# EasyEDA schematic SCH_fl-test_2024-12-06.json
TITLE: Sheet_1; REV: 1.0; Date: 2024-12-06; Sheet: 1/1; Drawn By: michaelfolger123; Company: Your Company
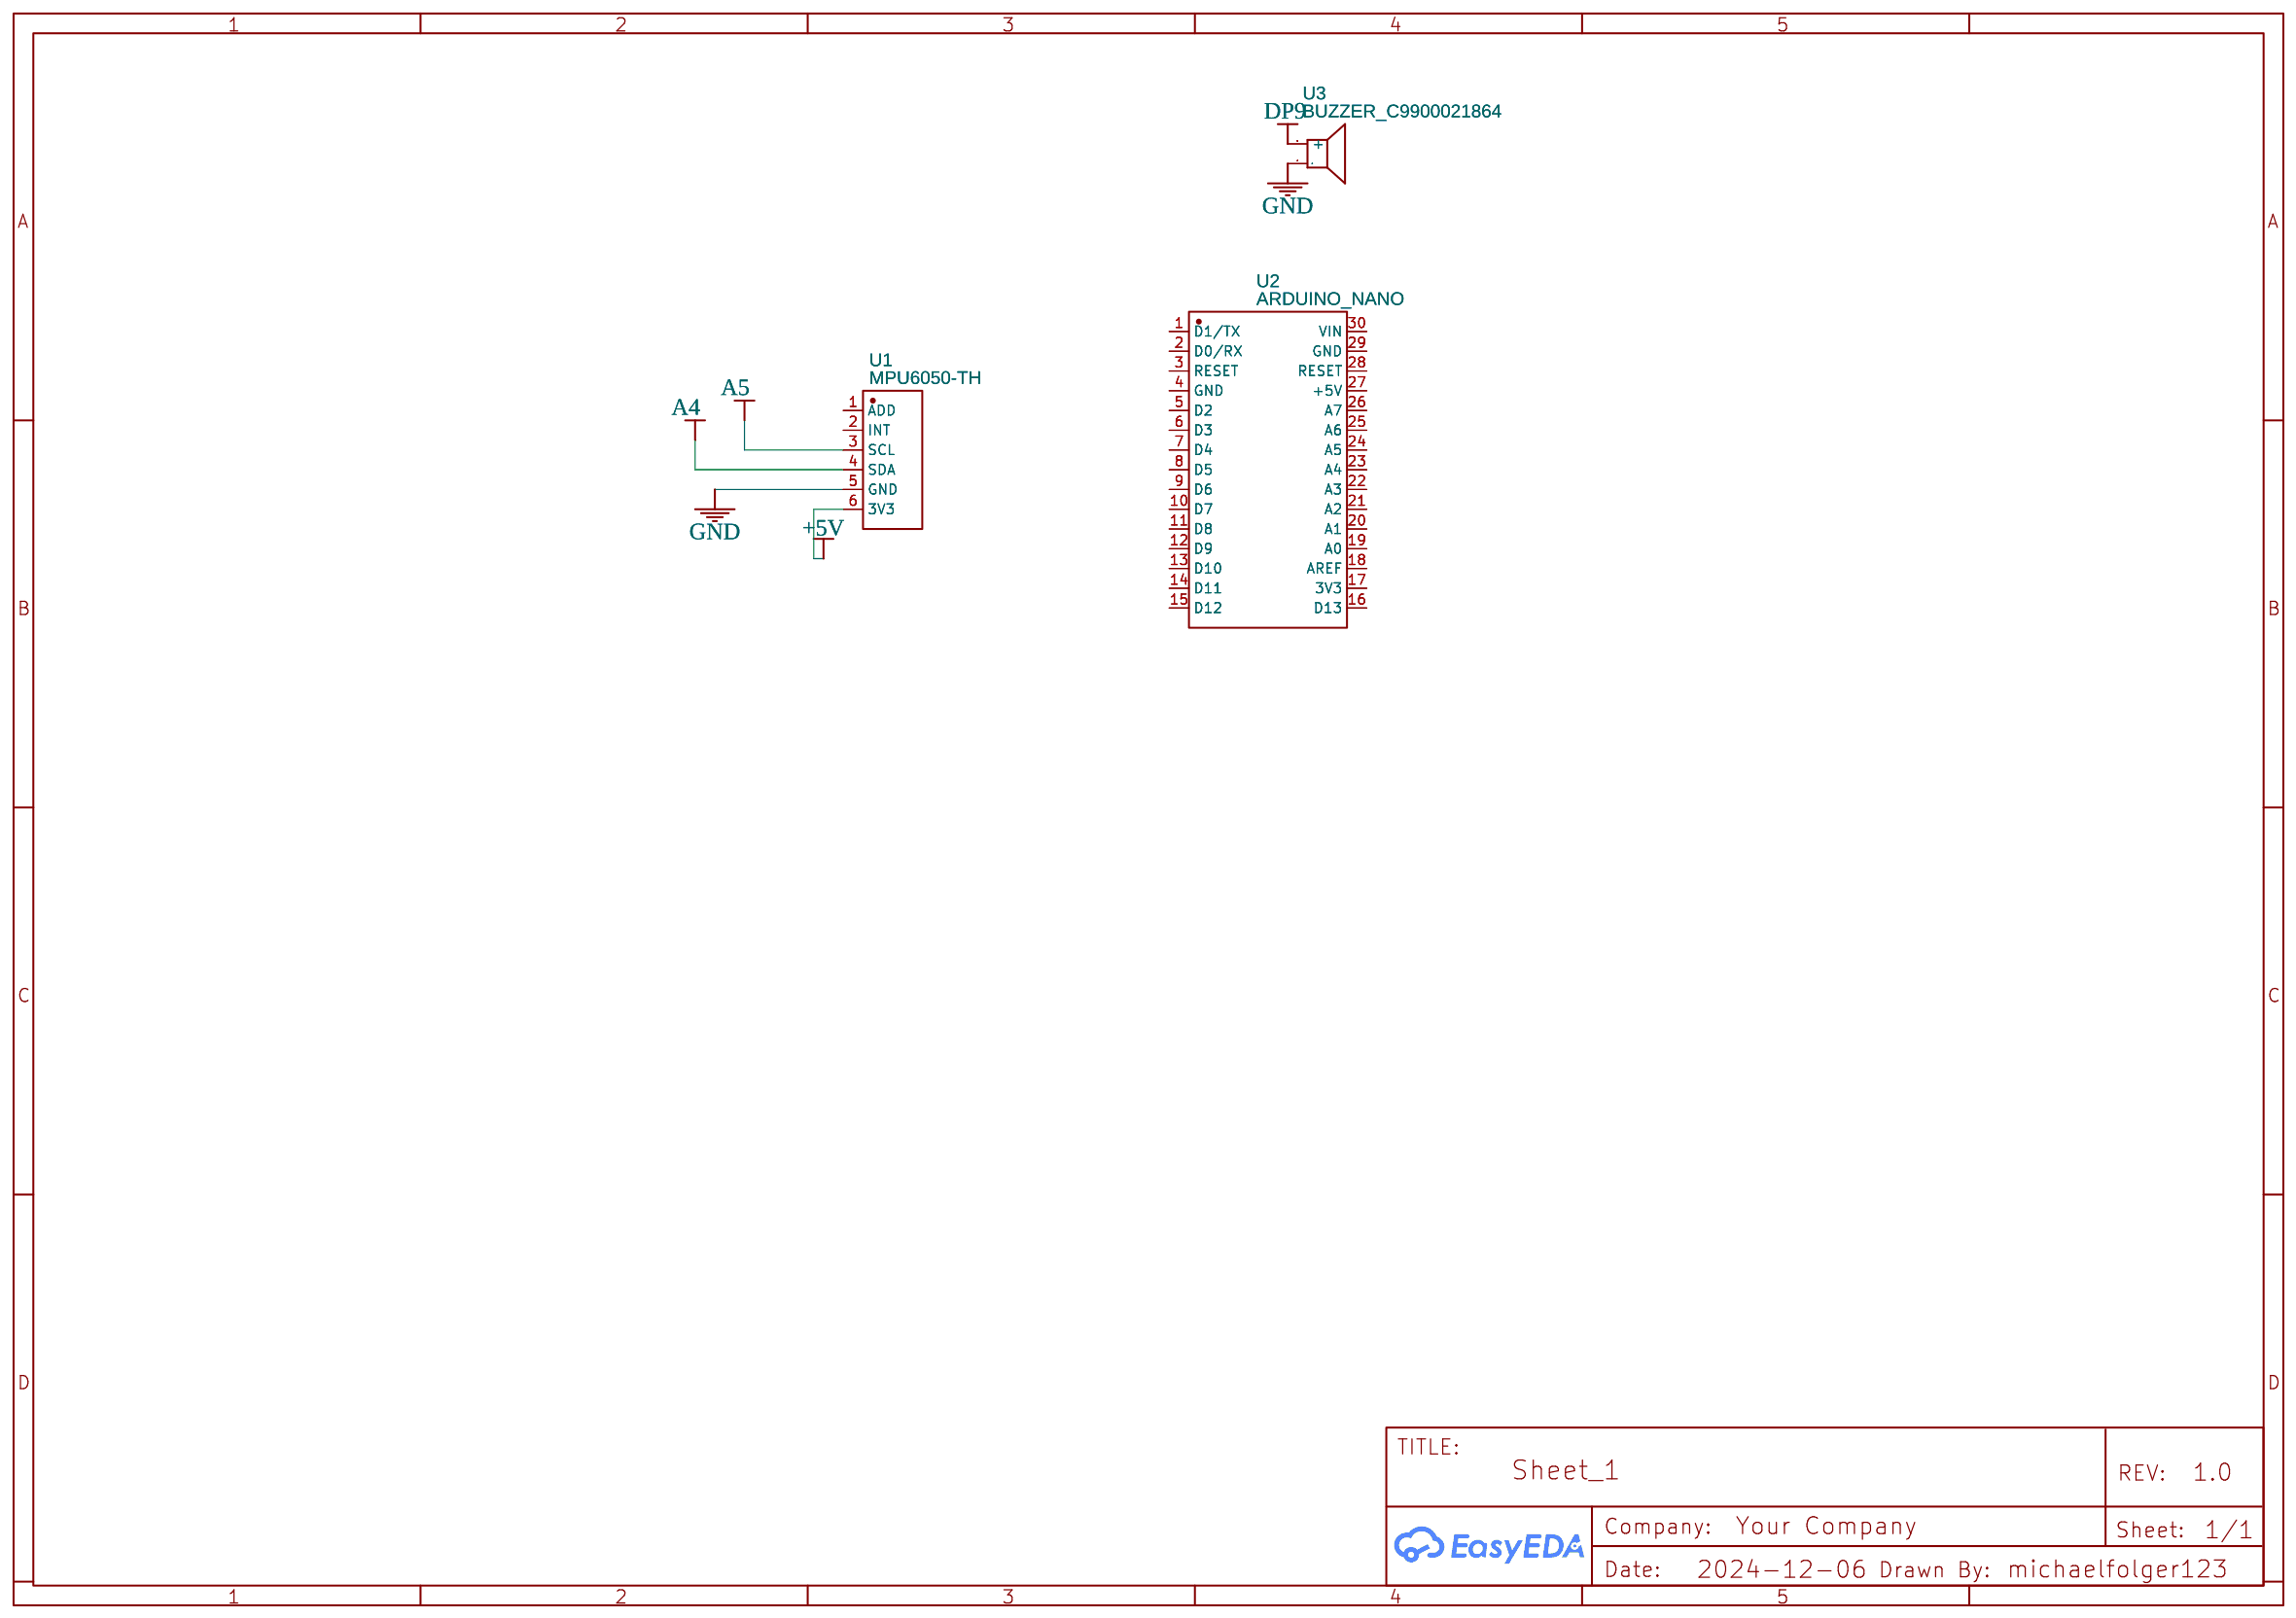
[diagram p0: schematic sheet]

## Parts
U1  MPU6050-TH  [COMM-TH_MPU6050-TH]
U2  ARDUINO_NANO  [COMM-TH_ARDUINO_NANO]
U3  BUZZER_C9900021864  [BUZ-SMD_BUZZER]

## Library data of the parts
U1 = MPU6050-TH: Supplier: LCSC; Supplier Part: C9900132629; Manufacturer: null; Contributor: lcsc
U2 = ARDUINO_NANO: Contributor: lcsc; Supplier: LCSC; Supplier Part: C9900017879; Manufacturer: null; JLCPCB Part Class: Extended Part
U3 = BUZZER_C9900021864: Contributor: lcsc; Supplier: LCSC; Supplier Part: C9900021864; Manufacturer: null; Manufacturer Part: BUZZER; JLCPCB Part Class: Extended Part

## Nets
+5V: U1.6(3V3)
GND: U1.5(GND) U3.1
A4: U1.4(SDA)
A5: U1.3(SCL)
DP9: U3.2(+)

Not connected (* = marked no-connect by the designer): U1 1(ADD) 2(INT); U2 1(D1/TX) 2(D0/RX) 3(RESET) 4(GND) 5(D2) 6(D3) 7(D4) 8(D5) 9(D6) 10(D7) 11(D8) 12(D9) 13(D10) 14(D11) 15(D12) 16(D13) 17(3V3) 18(AREF) 19(A0) 20(A1) 21(A2) 22(A3) 23(A4) 24(A5) 25(A6) 26(A7) 27(+5V) 28(RESET) 29(GND) 30(VIN)

## Notes on the sheet
- Text
- The MPU6050 is an accelerometer and gyroscope sensor that communicates with the Arduino Nano
  using the I2C protocol.
  Here are the necessary connections:
  1. VCC (MPU6050) to 5V (Arduino Nano): This provides power to the sensor.
  2. GND (MPU6050) to GND (Arduino Nano): Connects the ground of both components to establish
  a common reference.
  3. SCL (MPU6050) to A5 (Arduino Nano): This is the clock line for I2C communication, allowing
  synchronization of data.
  4. SDA (MPU6050) to A4 (Arduino Nano): This is the data line for I2C, which carries the sensor data
- Text
- Text
